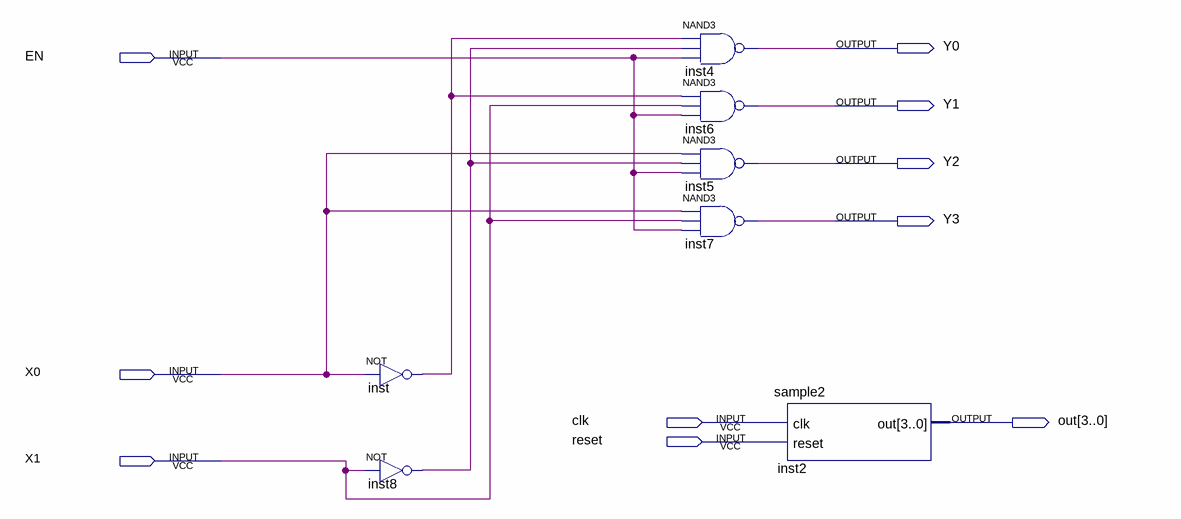
[diagram p0: schematic sheet]
// Quartus schematic test.bdf as structural Verilog: 7 symbols, 10 pins
module test (
  input  EN,
  input  X0,
  input  clk,
  input  reset,
  input  X1,
  output Y0,
  output Y1,
  output Y2,
  output Y3,
  output [3:0] out
);

  wire inst8_out, inst_out;

  not inst (inst_out, X0);
  not inst8 (inst8_out, X1);
  nand inst4 (Y0, inst_out, inst8_out, EN);
  nand inst6 (Y1, inst_out, X1, EN);
  nand inst5 (Y2, X0, inst8_out, EN);
  nand inst7 (Y3, X0, X1, EN);
  sample2 inst2 (.clk(clk), .reset(reset), .out(out));
endmodule
